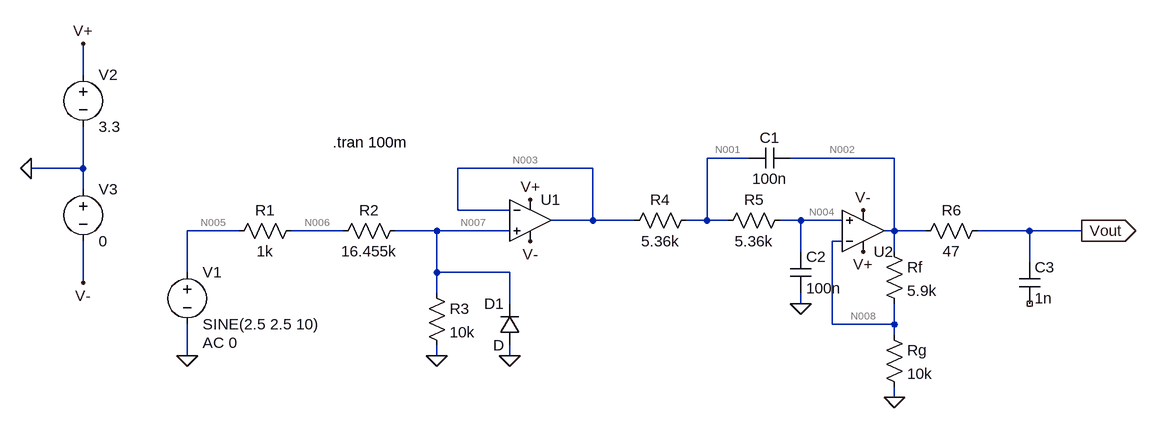
[diagram p0: schematic daq_analog_frontend.asc]
daq_analog_frontend.asc, the LTspice schematic file:
Version 4.1
SHEET 1 1296 680
WIRE -352 -192 -352 -240
WIRE 672 -64 608 -64
WIRE 896 -64 736 -64
WIRE -352 -48 -352 -112
WIRE -352 -48 -432 -48
WIRE 432 -48 224 -48
WIRE -352 -16 -352 -48
WIRE 224 16 224 -48
WIRE 304 16 224 16
WIRE 432 32 432 -48
WIRE 432 32 368 32
WIRE 496 32 432 32
WIRE 608 32 608 -64
WIRE 608 32 576 32
WIRE 640 32 608 32
WIRE 752 32 720 32
WIRE 816 32 752 32
WIRE -112 48 -192 48
WIRE 48 48 -32 48
WIRE 192 48 128 48
WIRE 304 48 192 48
WIRE 896 48 896 -64
WIRE 896 48 880 48
WIRE 944 48 896 48
WIRE 1104 48 1024 48
WIRE 1184 48 1104 48
WIRE 816 64 800 64
WIRE 752 80 752 32
WIRE 896 80 896 48
WIRE 1104 96 1104 48
WIRE -192 112 -192 48
WIRE 192 112 192 48
WIRE 304 112 192 112
WIRE -352 128 -352 64
WIRE 192 144 192 112
WIRE 304 160 304 112
WIRE 752 160 752 144
WIRE 800 192 800 64
WIRE 896 192 896 160
WIRE 896 192 800 192
WIRE 896 208 896 192
WIRE -192 240 -192 192
WIRE 192 240 192 224
WIRE 304 240 304 224
WIRE 896 304 896 288
FLAG -192 240 0
FLAG 192 240 0
FLAG 304 240 0
FLAG 336 0 V+
FLAG 336 64 V-
FLAG -352 -240 V+
FLAG -352 128 V-
FLAG -432 -48 0
FLAG 752 160 0
FLAG 896 304 0
FLAG 848 80 V+
FLAG 848 16 V-
FLAG 1184 48 Vout
IOPIN 1184 48 Out
SYMBOL res -16 32 R90
WINDOW 0 0 56 VBottom 2
WINDOW 3 32 56 VTop 2
SYMATTR InstName R1
SYMATTR Value 1k
SYMBOL voltage -192 96 R0
WINDOW 123 24 124 Left 2
WINDOW 39 0 0 Left 0
SYMATTR Value2 AC 0
SYMATTR InstName V1
SYMATTR Value SINE(2.5 2.5 10)
SYMBOL res 144 32 R90
WINDOW 0 0 56 VBottom 2
WINDOW 3 32 56 VTop 2
SYMATTR InstName R2
SYMATTR Value 16.455k
SYMBOL res 176 128 R0
SYMATTR InstName R3
SYMATTR Value 10k
SYMBOL diode 320 224 R180
WINDOW 0 24 64 Left 2
WINDOW 3 24 0 Left 2
SYMATTR InstName D1
SYMBOL OpAmps\\UniversalOpAmp2 336 32 R0
SYMATTR InstName U1
SYMBOL voltage -352 -208 R0
SYMATTR InstName V2
SYMATTR Value 3.3
SYMBOL voltage -352 -32 R0
SYMATTR InstName V3
SYMATTR Value 0
SYMBOL res 592 16 R90
WINDOW 0 0 56 VBottom 2
WINDOW 3 32 56 VTop 2
SYMATTR InstName R4
SYMATTR Value 5.36k
SYMBOL cap 736 -80 R90
WINDOW 0 0 32 VBottom 2
WINDOW 3 32 32 VTop 2
SYMATTR InstName C1
SYMATTR Value 100n
SYMBOL res 736 16 R90
WINDOW 0 0 56 VBottom 2
WINDOW 3 32 56 VTop 2
SYMATTR InstName R5
SYMATTR Value 5.36k
SYMBOL cap 736 80 R0
SYMATTR InstName C2
SYMATTR Value 100n
SYMBOL OpAmps\\UniversalOpAmp2 848 48 M180
SYMATTR InstName U2
SYMBOL res 880 64 R0
SYMATTR InstName Rf
SYMATTR Value 5.9k
SYMBOL res 880 192 R0
SYMATTR InstName Rg
SYMATTR Value 10k
SYMBOL res 1040 32 R90
WINDOW 0 0 56 VBottom 2
WINDOW 3 32 56 VTop 2
SYMATTR InstName R6
SYMATTR Value 47
SYMBOL cap 1088 96 R0
SYMATTR InstName C3
SYMATTR Value 1n
TEXT 32 -88 Left 2 !.tran 100m

The netlist it stands for:
* daq_analog_frontend.asc
R1 N006 N005 1k
V1 N005 0 SINE(2.5 2.5 10) AC 0
R2 N007 N006 16.455k
R3 N007 0 10k
D1 0 N007 D
X§U1 N007 N003 V+ V- N003 level2 Avol=1Meg GBW=10Meg Slew=10Meg Ilimit=25m Rail=0 Vos=0 En=0 Enk=0 In=0 Ink=0 Rin=500Meg  ; pins In+ In- V+ V- OUT
V2 V+ 0 3.3
V3 0 V- 0
R4 N001 N003 5.36k
C1 N002 N001 100n
R5 N004 N001 5.36k
C2 N004 0 100n
X§U2 N004 N008 V+ V- N002 level2 Avol=1Meg GBW=10Meg Slew=10Meg Ilimit=25m Rail=0 Vos=0 En=0 Enk=0 In=0 Ink=0 Rin=500Meg  ; pins In+ In- V+ V- OUT
Rf N002 N008 5.9k
Rg N008 0 10k
R6 Vout N002 47
C3 Vout NC_01 1n
.model D D
.lib standard.dio
.tran 100m
.lib UniversalOpAmp2.lib
.backanno
.end

* Results of the author's LTspice run, read from the files saved beside the schematic
* Operating Point, zero values left out:
*   V(n001) = 910.6 mV
*   V(n002) = 1.448 V
*   V(n003) = 910.6 mV
*   V(n004) = 910.6 mV
*   V(n005) = 2.5 V
*   V(n006) = 2.409 V
*   V(n007) = 910.6 mV
*   V(n008) = 910.6 mV
*   V(v+) = 3.3 V
*   V(vout) = 1.448 V
*   I(R1) = -91.06 µA
*   I(R2) = -91.06 µA
*   I(R3) = 91.06 µA
*   I(R4) = 1.479 nA
*   I(R5) = 1.479 nA
*   I(Rf) = 91.06 µA
*   I(Rg) = 91.06 µA
*   I(V1) = -91.06 µA
*   I(V2) = -363 µA
*   I(V3) = -272 µA
*   Ix(u1:1) = -1.479 nA
*   Ix(u1:2) = -1.479 nA
*   Ix(u1:3) = 147.5 µA
*   Ix(u1:4) = -147.5 µA
*   Ix(u1:5) = 2.958 nA
*   Ix(u2:1) = -1.479 nA
*   Ix(u2:2) = -1.479 nA
*   Ix(u2:3) = 215.5 µA
*   Ix(u2:4) = -124.4 µA
*   Ix(u2:5) = -91.06 µA
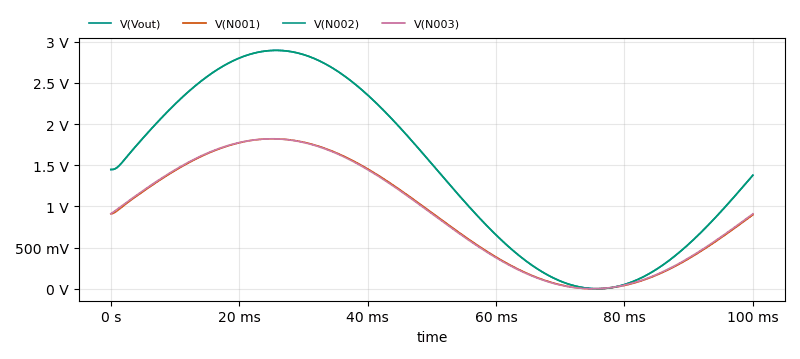
[diagram p1: Transient Analysis of daq_analog_frontend.asc, plotted from the saved traces]
* Transient Analysis, 1 run:
*   V(Vout): min 225 µV, max 2.896 V, average 1.448 V, rms 1.773 V, last 1.379 V
*   V(N001): min -417.6 µV, max 1.822 V, average 910.5 mV, rms 1.115 V, last 898 mV
*   V(N002): min 225 µV, max 2.896 V, average 1.448 V, rms 1.773 V, last 1.379 V
*   V(N003): min 87.78 µV, max 1.821 V, average 910.6 mV, rms 1.115 V, last 910.6 mV